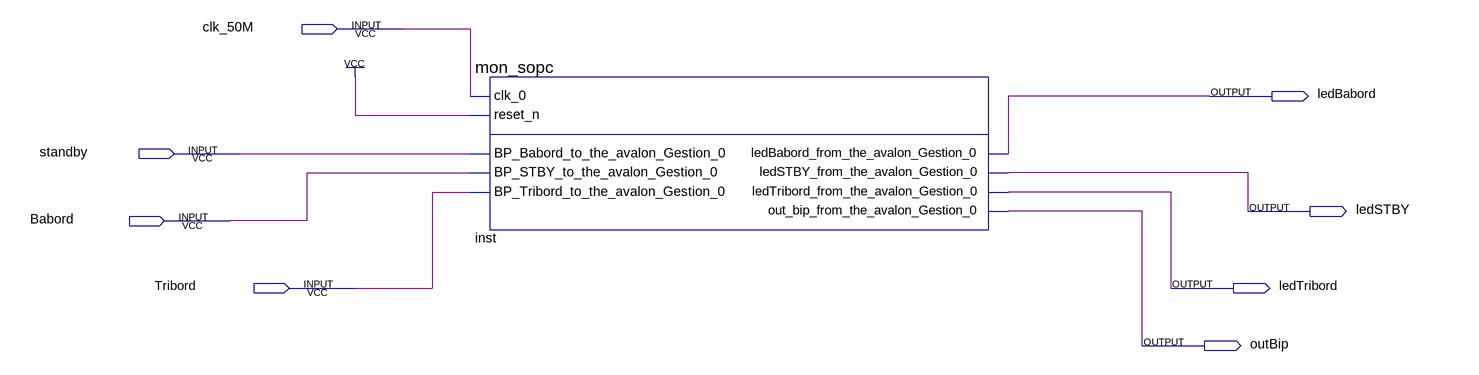
[diagram p0: schematic sheet]
// Quartus schematic gestion_boutons.bdf as structural Verilog: 1 symbols, 8 pins
module gestion_boutons (
  input  clk_50M,
  input  standby,
  input  Babord,
  input  Tribord,
  output ledBabord,
  output ledSTBY,
  output ledTribord,
  output outBip
);

  mon_sopc inst (
    .clk_0(clk_50M), .reset_n(1'b1), .BP_Babord_to_the_avalon_Gestion_0(standby),
    .BP_STBY_to_the_avalon_Gestion_0(Babord), .BP_Tribord_to_the_avalon_Gestion_0(Tribord),
    .ledBabord_from_the_avalon_Gestion_0(ledBabord), .ledSTBY_from_the_avalon_Gestion_0(ledSTBY),
    .ledTribord_from_the_avalon_Gestion_0(ledTribord), .out_bip_from_the_avalon_Gestion_0(outBip));
endmodule
